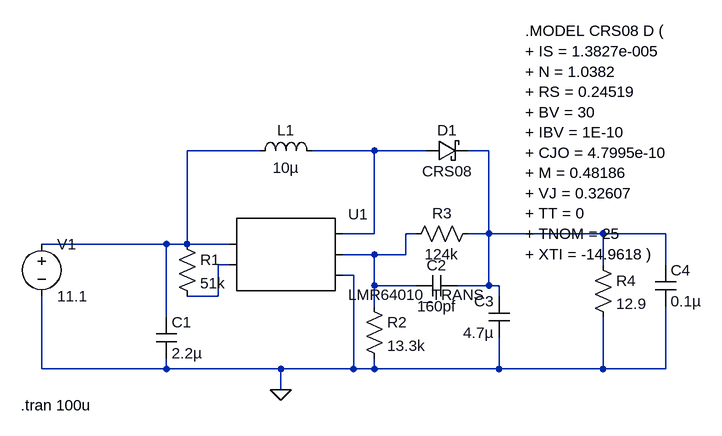
[diagram p0: schematic 11to12BoostSimulation.asc]
11to12BoostSimulation.asc, the LTspice schematic file:
Version 4
SHEET 1 880 680
WIRE 192 0 80 0
WIRE 368 0 272 0
WIRE 448 0 368 0
WIRE 544 0 512 0
WIRE 368 128 368 0
WIRE 368 128 320 128
WIRE 432 128 416 128
WIRE 544 128 544 0
WIRE 544 128 512 128
WIRE 720 128 544 128
WIRE 816 128 720 128
WIRE 48 144 -144 144
WIRE 80 144 80 0
WIRE 80 144 48 144
WIRE 144 144 80 144
WIRE 368 160 320 160
WIRE 416 160 416 128
WIRE 416 160 368 160
WIRE 144 176 128 176
WIRE 720 176 720 128
WIRE 816 176 816 128
WIRE 336 192 320 192
WIRE 368 208 368 160
WIRE 432 208 368 208
WIRE 544 208 544 128
WIRE 544 208 496 208
WIRE 560 208 544 208
WIRE 128 224 128 176
WIRE 128 224 80 224
WIRE 560 224 560 208
WIRE 368 240 368 208
WIRE 48 256 48 144
WIRE -144 336 -144 224
WIRE 48 336 48 320
WIRE 48 336 -144 336
WIRE 224 336 48 336
WIRE 336 336 336 192
WIRE 336 336 224 336
WIRE 368 336 368 320
WIRE 368 336 336 336
WIRE 560 336 560 288
WIRE 560 336 368 336
WIRE 720 336 720 256
WIRE 720 336 560 336
WIRE 816 336 816 240
WIRE 816 336 720 336
WIRE 224 368 224 336
FLAG 224 368 0
SYMBOL ind 176 16 R270
WINDOW 0 32 56 VTop 2
WINDOW 3 5 56 VBottom 2
SYMATTR InstName L1
SYMATTR Value 10µ
SYMBOL res 64 128 R0
SYMATTR InstName R1
SYMATTR Value 51k
SYMBOL cap 32 256 R0
SYMATTR InstName C1
SYMATTR Value 2.2µ
SYMBOL res 352 224 R0
SYMATTR InstName R2
SYMATTR Value 13.3k
SYMBOL cap 496 192 R90
WINDOW 0 0 32 VBottom 2
WINDOW 3 32 32 VTop 2
SYMATTR InstName C2
SYMATTR Value 160pf
SYMBOL cap 576 288 R180
WINDOW 0 24 56 Left 2
WINDOW 3 24 8 Left 2
SYMATTR InstName C3
SYMATTR Value 4.7µ
SYMBOL res 528 112 R90
WINDOW 0 0 56 VBottom 2
WINDOW 3 32 56 VTop 2
SYMATTR InstName R3
SYMATTR Value 124k
SYMBOL voltage -144 128 R0
WINDOW 123 0 0 Left 0
WINDOW 39 0 0 Left 0
SYMATTR InstName V1
SYMATTR Value 11.1
SYMBOL res 704 160 R0
SYMATTR InstName R4
SYMATTR Value 12.9
SYMBOL cap 800 176 R0
SYMATTR InstName C4
SYMATTR Value 0.1µ
SYMBOL schottky 448 16 R270
WINDOW 0 32 32 VTop 2
WINDOW 3 0 32 VBottom 2
SYMATTR InstName D1
SYMATTR Value CRS08
SYMBOL AutoGenerated/LMR64010_TRANS 224 160 R0
SYMATTR InstName U1
TEXT -176 392 Left 2 !.tran 100u
TEXT 600 -184 Left 2 !.MODEL CRS08 D (\n+ IS = 1.3827e-005\n+ N = 1.0382\n+ RS = 0.24519\n+ BV = 30\n+ IBV = 1E-10\n+ CJO = 4.7995e-10\n+ M = 0.48186\n+ VJ = 0.32607\n+ TT = 0\n+ TNOM = 25\n+ XTI = -14.9618 )

The netlist it stands for:
* 11to12BoostSimulation.asc
L1 N001 N002 10µ
R1 N001 N005 51k
C1 N001 0 2.2µ
R2 N004 0 13.3k
C2 N003 N004 160pf
C3 0 N003 4.7µ
R3 N003 N004 124k
V1 N001 0 11.1
R4 N003 0 12.9
C4 N003 0 0.1µ
D1 N002 N003 CRS08
* U1: LMR64010_TRANS (symbol AutoGenerated/LMR64010_TRANS not available, pins judged from their places): pin1=N001 pin2=N005 pin3=N002 pin4=N004 pin5=0
.model D D
.lib standard.dio
.tran 100u
.MODEL CRS08 D (
+ IS = 1.3827e-005
+ N = 1.0382
+ RS = 0.24519
+ BV = 30
+ IBV = 1E-10
+ CJO = 4.7995e-10
+ M = 0.48186
+ VJ = 0.32607
+ TT = 0
+ TNOM = 25
+ XTI = -14.9618 )
.backanno
.end